# EAGLE design LDAQ-MOD-ADC8 (EAGLE 9.6.2)
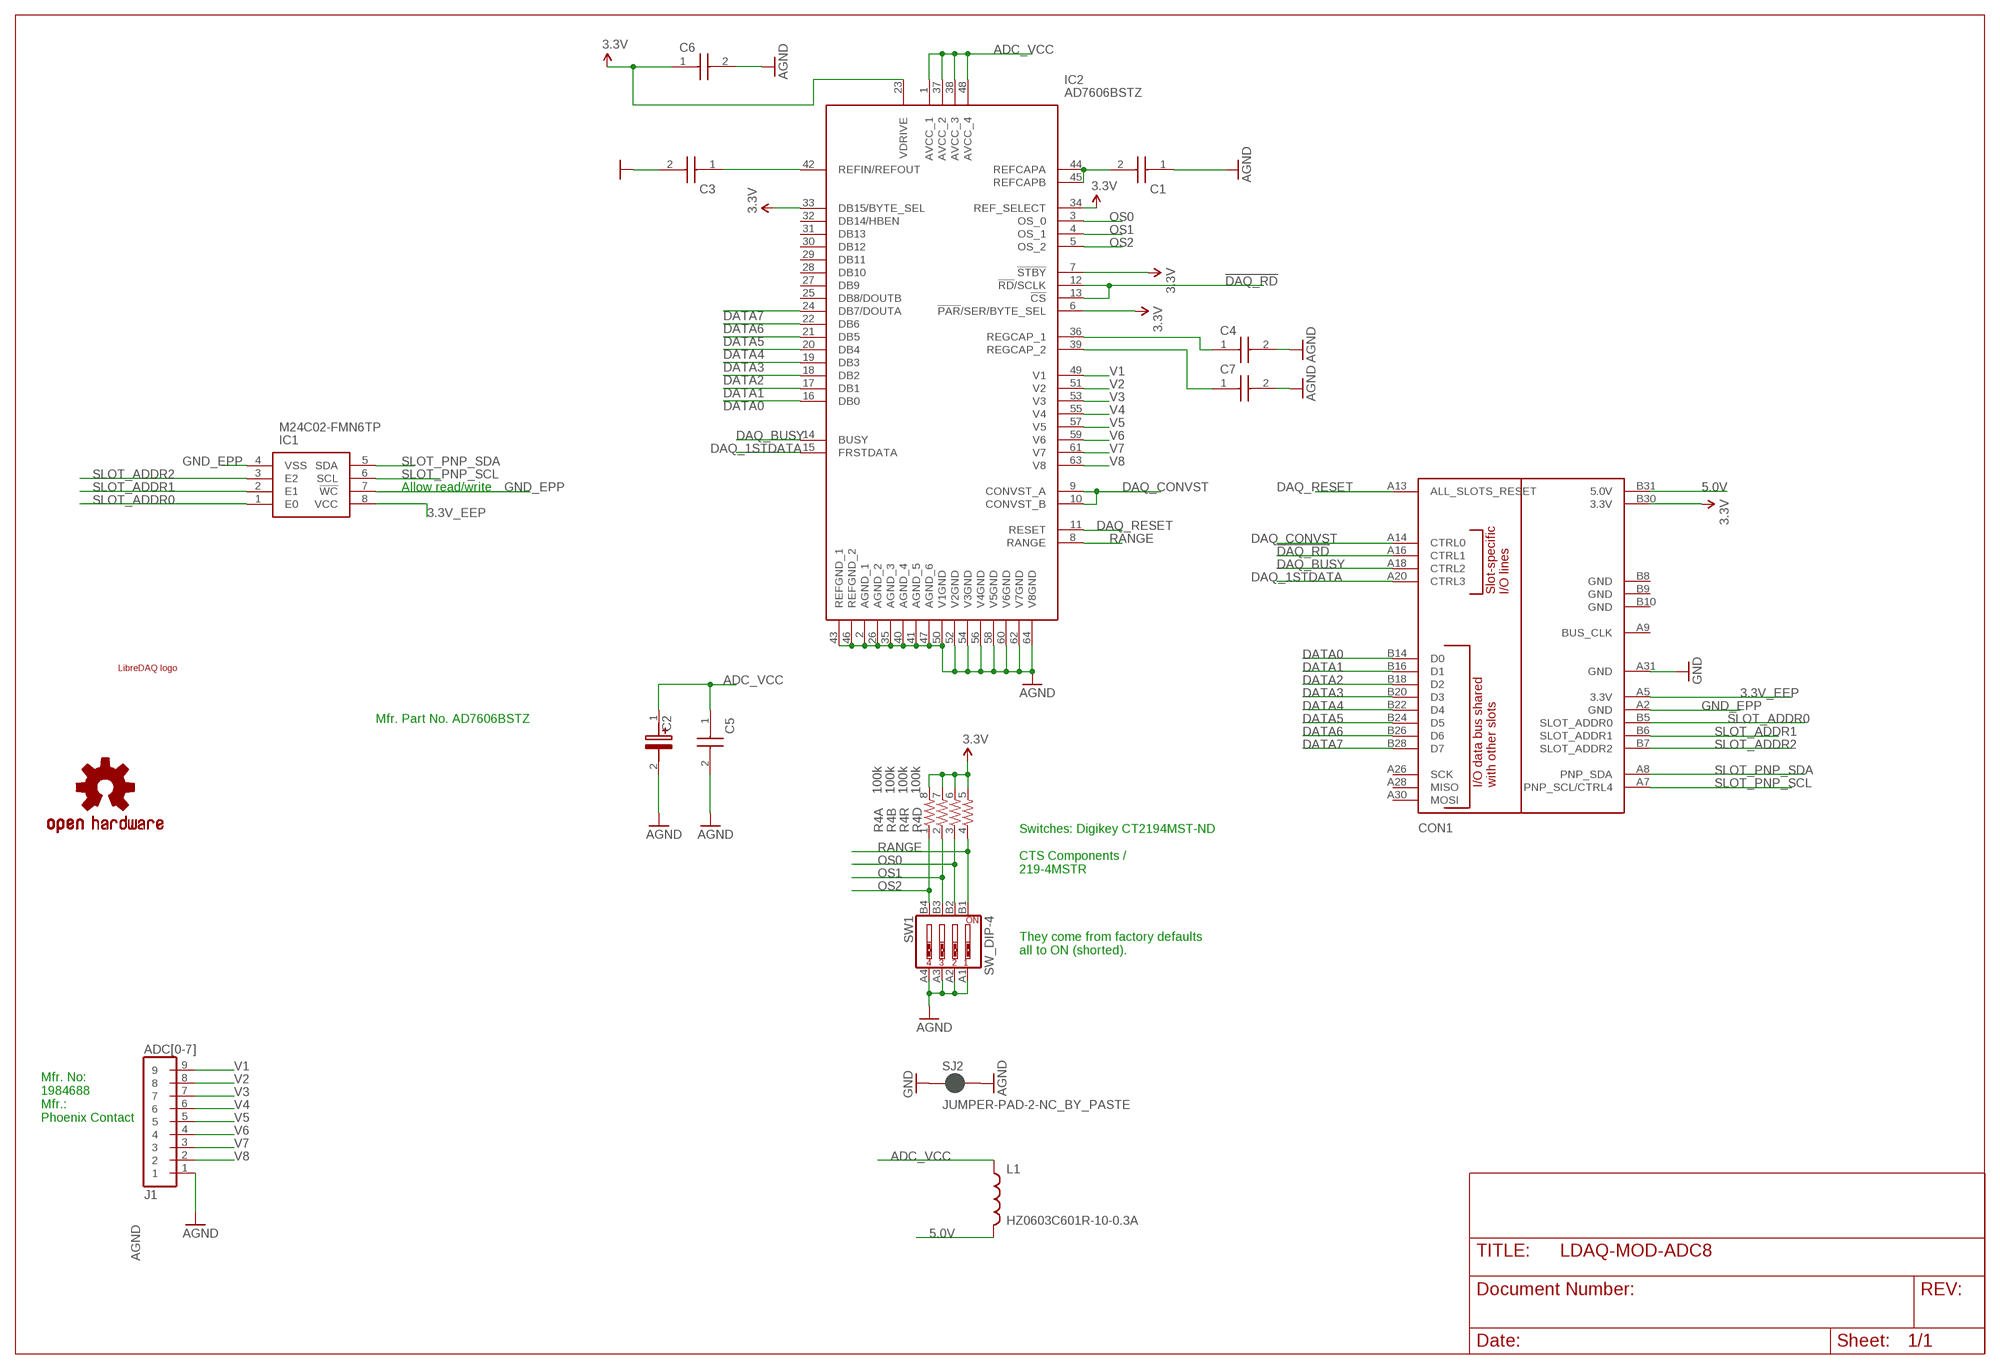
[diagram p0: schematic, sheet 1]

## Parts
C1  10uF  LMK105BJ225KV-F  [CAPC1005X55N]
C2  10uF  TAJB226M010RNJ  [CAPPM3528X210N]
C3  10uF  LMK105BJ225KV-F  [CAPC1005X55N]
C4  1.0uF  LMK105BJ225KV-F  [CAPC1005X55N]
C5  0.1uF  885012105010  [CAPC1005X55N]
C6  0.1uF  885012105010  [CAPC1005X55N]
C7  1.0uF  LMK105BJ225KV-F  [CAPC1005X55N]
CON1  BOARD  LIBREDAQ_DAUGHTER_BOARDPCIE-64-SIZE2  [PCI-E_64_EDGE_63X50]
IC1  M24C02-FMN6TP  [SOIC127P600X175-8N]
IC2  AD7606BSTZ  [QFP50P1200X1200X160-64N]
J1  ADC[0-7]  SCREWTERMINAL-3.5MM-9  [SCREWTERMINAL-3.5MM-9]
L1  HZ0603C601R-10-0.3A  INDUCTOR0603  [0603]
LOGO1  LIBREDAQ_LOGO_MINILOGO_GENERIC  [LIBREDAQ_LOGO]
LOGO2  OSHW-LOGOL  [OSHW-LOGO-L]
R4  100k  RESISTOR-ARRAY0603-ARV  [0603-ARV]
SJ2  JUMPER-PAD-2-NC_BY_PASTE  [PAD-JUMPER-2-NC_BY_PASTE_YES_SILK]
SW1  SW_DIP-4  [SW_SIP-4]

## Nets
3.3V: C6.1 CON1.B30(3.3V) IC2.6(!PAR!/SER/BYTE_SEL) IC2.7(!STBY) IC2.23(VDRIVE) IC2.33(DB15/BYTE_SEL) IC2.34(REF_SELECT) R4.5 R4.6 R4.7 R4.8
3.3V_EEP: CON1.A5(3.3V) IC1.8(VCC)
5.0V: CON1.B31(5.0V) L1.2
!DAQ_RD: CON1.A16(CTRL1) IC2.12(!RD!/SCLK) IC2.13(!CS)
ADC_VCC: C2.1(+) C5.1 IC2.1(AVCC_1) IC2.37(AVCC_2) IC2.38(AVCC_3) IC2.48(AVCC_4) L1.1
AGND: C1.1 C2.2(-) C3.2 C4.2 C5.2 C6.2 C7.2 IC2.2(AGND_1) IC2.26(AGND_2) IC2.35(AGND_3) IC2.40(AGND_4) IC2.41(AGND_5) IC2.43(REFGND_1) IC2.46(REFGND_2) IC2.47(AGND_6) IC2.50(V1GND) IC2.52(V2GND) IC2.54(V3GND) IC2.56(V4GND) IC2.58(V5GND) IC2.60(V6GND) IC2.62(V7GND) IC2.64(V8GND) J1.1 SJ2.2 SW1.A1 SW1.A2 SW1.A3 SW1.A4
DAQ_1STDATA: CON1.A20(CTRL3) IC2.15(FRSTDATA)
DAQ_BUSY: CON1.A18(CTRL2) IC2.14(BUSY)
DAQ_CONVST: CON1.A14(CTRL0) IC2.9(CONVST_A) IC2.10(CONVST_B)
DAQ_RESET: CON1.A13(ALL_SLOTS_RESET) IC2.11(RESET)
DATA0: CON1.B14(D0) IC2.16(DB0)
DATA1: CON1.B16(D1) IC2.17(DB1)
DATA2: CON1.B18(D2) IC2.18(DB2)
DATA3: CON1.B20(D3) IC2.19(DB3)
DATA4: CON1.B22(D4) IC2.20(DB4)
DATA5: CON1.B24(D5) IC2.21(DB5)
DATA6: CON1.B26(D6) IC2.22(DB6)
DATA7: CON1.B28(D7) IC2.24(DB7/DOUTA)
GND: CON1.A31(GND) SJ2.1
GND_EPP: CON1.A2(GND) IC1.4(VSS) IC1.7(!WC)
N$1: C1.2 IC2.44(REFCAPA) IC2.45(REFCAPB)
N$2: C4.1 IC2.36(REGCAP_1)
N$3: C7.1 IC2.39(REGCAP_2)
N$35: C3.1 IC2.42(REFIN/REFOUT)
OS0: IC2.3(OS_0) R4.3 SW1.B2
OS1: IC2.4(OS_1) R4.2 SW1.B3
OS2: IC2.5(OS_2) R4.1 SW1.B4
RANGE: IC2.8(RANGE) R4.4 SW1.B1
SLOT_ADDR0: CON1.B5(SLOT_ADDR0) IC1.1(E0)
SLOT_ADDR1: CON1.B6(SLOT_ADDR1) IC1.2(E1)
SLOT_ADDR2: CON1.B7(SLOT_ADDR2) IC1.3(E2)
SLOT_PNP_SCL: CON1.A7(PNP_SCL/CTRL4) IC1.6(SCL)
SLOT_PNP_SDA: CON1.A8(PNP_SDA) IC1.5(SDA)
V1: IC2.49(V1) J1.9
V2: IC2.51(V2) J1.8
V3: IC2.53(V3) J1.7
V4: IC2.55(V4) J1.6
V5: IC2.57(V5) J1.5
V6: IC2.59(V6) J1.4
V7: IC2.61(V7) J1.3
V8: IC2.63(V8) J1.2
Unconnected: CON1.A9(BUS_CLK) CON1.A26(SCK) CON1.A28(MISO) CON1.A30(MOSI) CON1.B8(GND) CON1.B9(GND) CON1.B10(GND) IC2.25(DB8/DOUTB) IC2.27(DB9) IC2.28(DB10) IC2.29(DB11) IC2.30(DB12) IC2.31(DB13) IC2.32(DB14/HBEN)

## Notes on the sheet
- Allow read/write
- Mfr. Part No. AD7606BSTZ
- Switches: Digikey CT2194MST-ND
  
  CTS Components / 
  219-4MSTR
  
  
  
  
  They come from factory defaults 
  all to ON (shorted).
- Mfr. No:
  1984688
  Mfr.:
  Phoenix Contact

## Library data of the parts
C1 C3 C4 C7 = LMK105BJ225KV-F:LMK105BJ225KV-F: TAIYO YUDEN - LMK105BJ225KV-F - CAP ,MLCC ,0402,10V ,X5R,2.2UF10% ,T&R Source: Datasheet <https://datasheet.lcsc.com/szlcsc/Taiyo-Yuden-LMK105BJ225KV-F_C319191.pdf>; DESCRIPTION: TAIYO YUDEN - LMK105BJ225KV-F - CAP ,MLCC ,0402,10V ,X5R,2.2UF10% ,T&R; HEIGHT: 0.55mm; MANUFACTURER_NAME: TAIYO YUDEN; MANUFACTURER_PART_NUMBER: LMK105BJ225KV-F; MOUSER_PART_NUMBER: 963-LMK105BJ225KV-F; MOUSER_PRICE-STOCK: https://www.mouser.co.uk/ProductDetail/Taiyo-Yuden/LMK105BJ225KV-F?qs=lkMpTOwszhdMcDOeuc5Dig%3D%3D
C2 = TAJB226M010RNJ:TAJB226M010RNJ: Tantalum Capacitors - Solid SMD 10volts 22uF 20% Source: Datasheet <http://datasheets.avx.com/TAJ.pdf>; DESCRIPTION: Tantalum Capacitors - Solid SMD 10volts 22uF 20%; HEIGHT: 2.1mm; MANUFACTURER_NAME: AVX; MANUFACTURER_PART_NUMBER: TAJB226M010RNJ; MOUSER_PART_NUMBER: 581-TAJB226M010R; MOUSER_PRICE-STOCK: https://www.mouser.co.uk/ProductDetail/AVX/TAJB226M010RNJ?qs=mgX5NEyWO4RGWl43WOyCZQ%3D%3D
C5 C6 = 885012105010:885012105010: Multilayer Ceramic Chip Capacitor WCAP-CSGP Series 0402 100000pF X5R0402104M010DFCT10000 Source: Datasheet <https://katalog.we-online.com/pbs/datasheet/885012105010.pdf>; DESCRIPTION: Multilayer Ceramic Chip Capacitor WCAP-CSGP Series 0402 100000pF X5R0402104M010DFCT10000; HEIGHT: 0.55mm; MANUFACTURER_NAME: Wurth Elektronik; MANUFACTURER_PART_NUMBER: 885012105010; MOUSER_PART_NUMBER: 710-885012105010; MOUSER_PRICE-STOCK: https://www.mouser.co.uk/ProductDetail/Wurth-Elektronik/885012105010?qs=0KOYDY2FL298aE%252BL5D%252BNKw%3D%3D
CON1 = libredaq-comps:LIBREDAQ_DAUGHTER_BOARD: LibreDAQ Expansion board (PCI-E form)
IC1 = SamacSys_Parts:M24C02-FMN6TP: EEPROM 2-Kbit serial I2C Bus EEPROM Source: Datasheet <http://www.st.com/content/ccc/resource/technical/document/datasheet/b0/d8/50/40/5a/85/49/6f/DM00071904.pdf/files/DM00071904.pdf/jcr:content/translations/en.DM00071904.pdf>; DESCRIPTION: EEPROM 2-Kbit serial I2C Bus EEPROM; HEIGHT: 1.75mm; MANUFACTURER_NAME: STMicroelectronics; MANUFACTURER_PART_NUMBER: M24C02-FMN6TP; MOUSER_PART_NUMBER: 511-M24C02-FMN6TP; MOUSER_PRICE-STOCK: https://www.mouser.co.uk/ProductDetail/STMicroelectronics/M24C02-FMN6TP?qs=WHlX%252B%252B9%2FRwCvVyrf2ztAog%3D%3D
IC2 = SamacSys_Parts:AD7606BSTZ: Bipolar Input, Simultaneous Sampling ADC Source: Datasheet <https://componentsearchengine.com/Datasheets/2/AD7606BSTZ.pdf>; DESCRIPTION: Bipolar Input, Simultaneous Sampling ADC; HEIGHT: 1.6mm; MANUFACTURER_NAME: Analog Devices; MANUFACTURER_PART_NUMBER: AD7606BSTZ; MOUSER_PART_NUMBER: 584-AD7606BSTZ; MOUSER_PRICE-STOCK: https://www.mouser.co.uk/ProductDetail/Analog-Devices/AD7606BSTZ?qs=%2FtpEQrCGXCxOGkaD7urMag%3D%3D
J1 = libredaq-comps:SCREWTERMINAL-3.5MM-9
L1 = SparkFun-Passives:INDUCTOR: Inductors Basic Inductor/Choke - 0603 and 1206. Footprints are not proven and vary greatly between part numbers. SRN6045- 33uH, 20% 1.4A SDR0403-560KL - 56uH, 10%, 500mA RMS/740mA peak
LOGO1 = libredaq-comps:LIBREDAQ_LOGO_MINI
LOGO2 = SparkFun-Aesthetics:OSHW-LOGO: Open Source Hardware Logo This logo indicates the piece of hardware it is found on incorporates a OSHW license and/or adheres to the definition of open source hardware found here: http://freedomdefined.org/OSHW
R4 = SparkFun-Resistors:RESISTOR-ARRAY: Array Chip Resistor Source: RS Component / Phycomp
SJ2 = SparkFun-Passives:JUMPER-PAD-2-NC_BY_PASTE
SW1 = libredaq-comps:SW_DIP-4

## Board
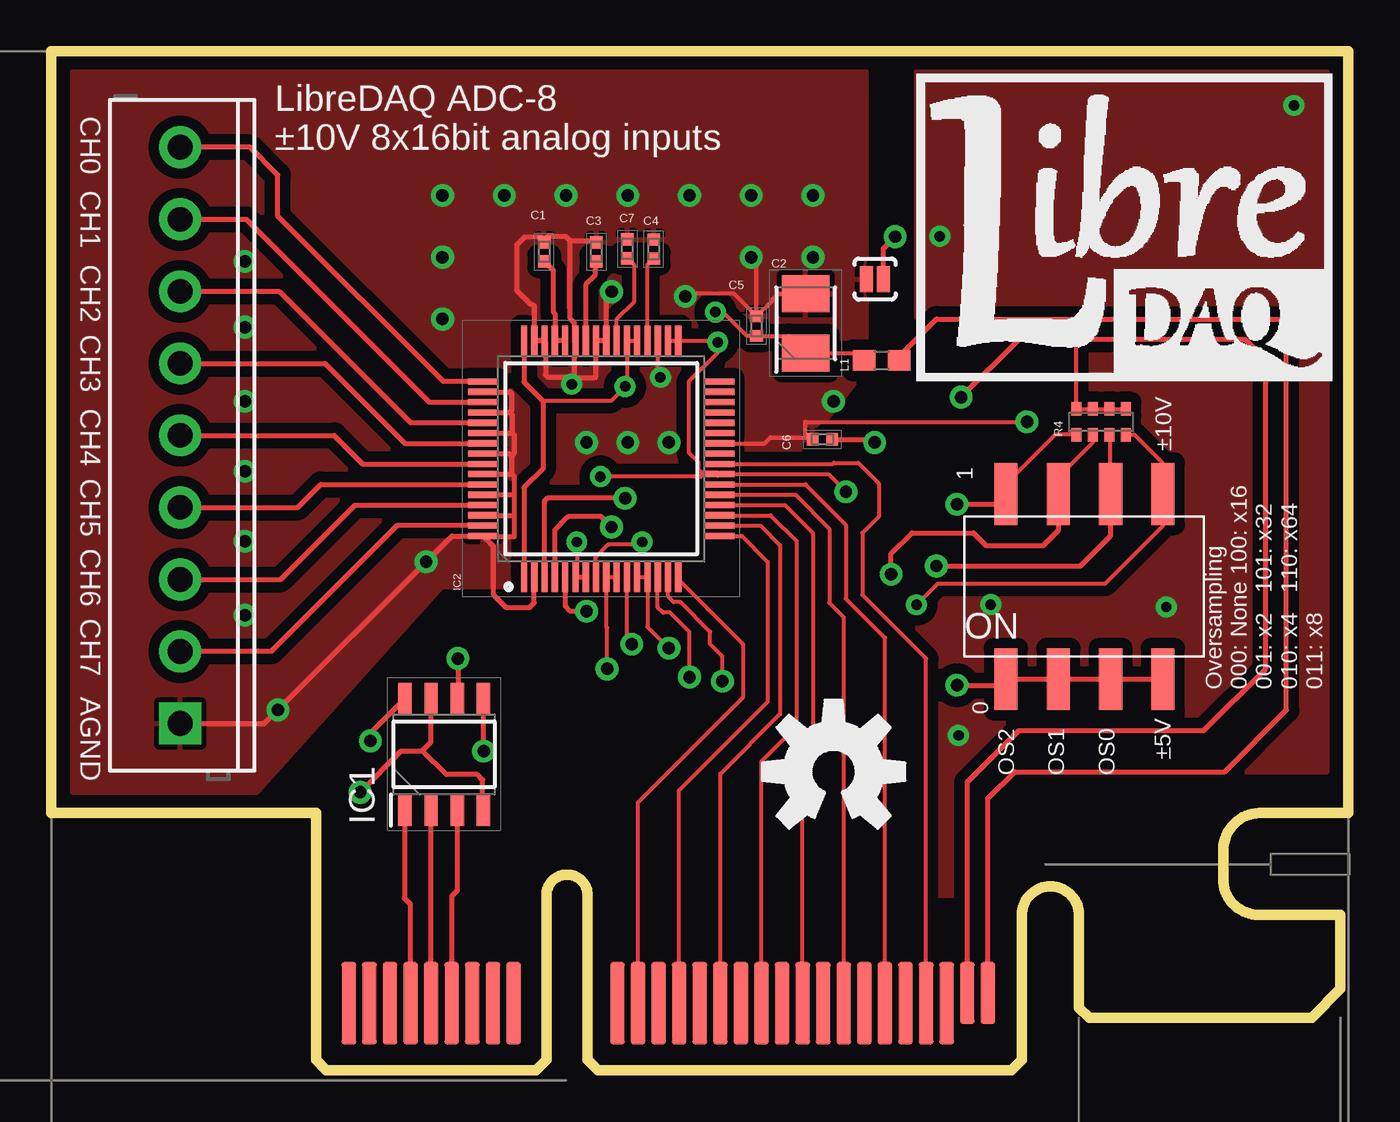
[diagram p1: board, top side]
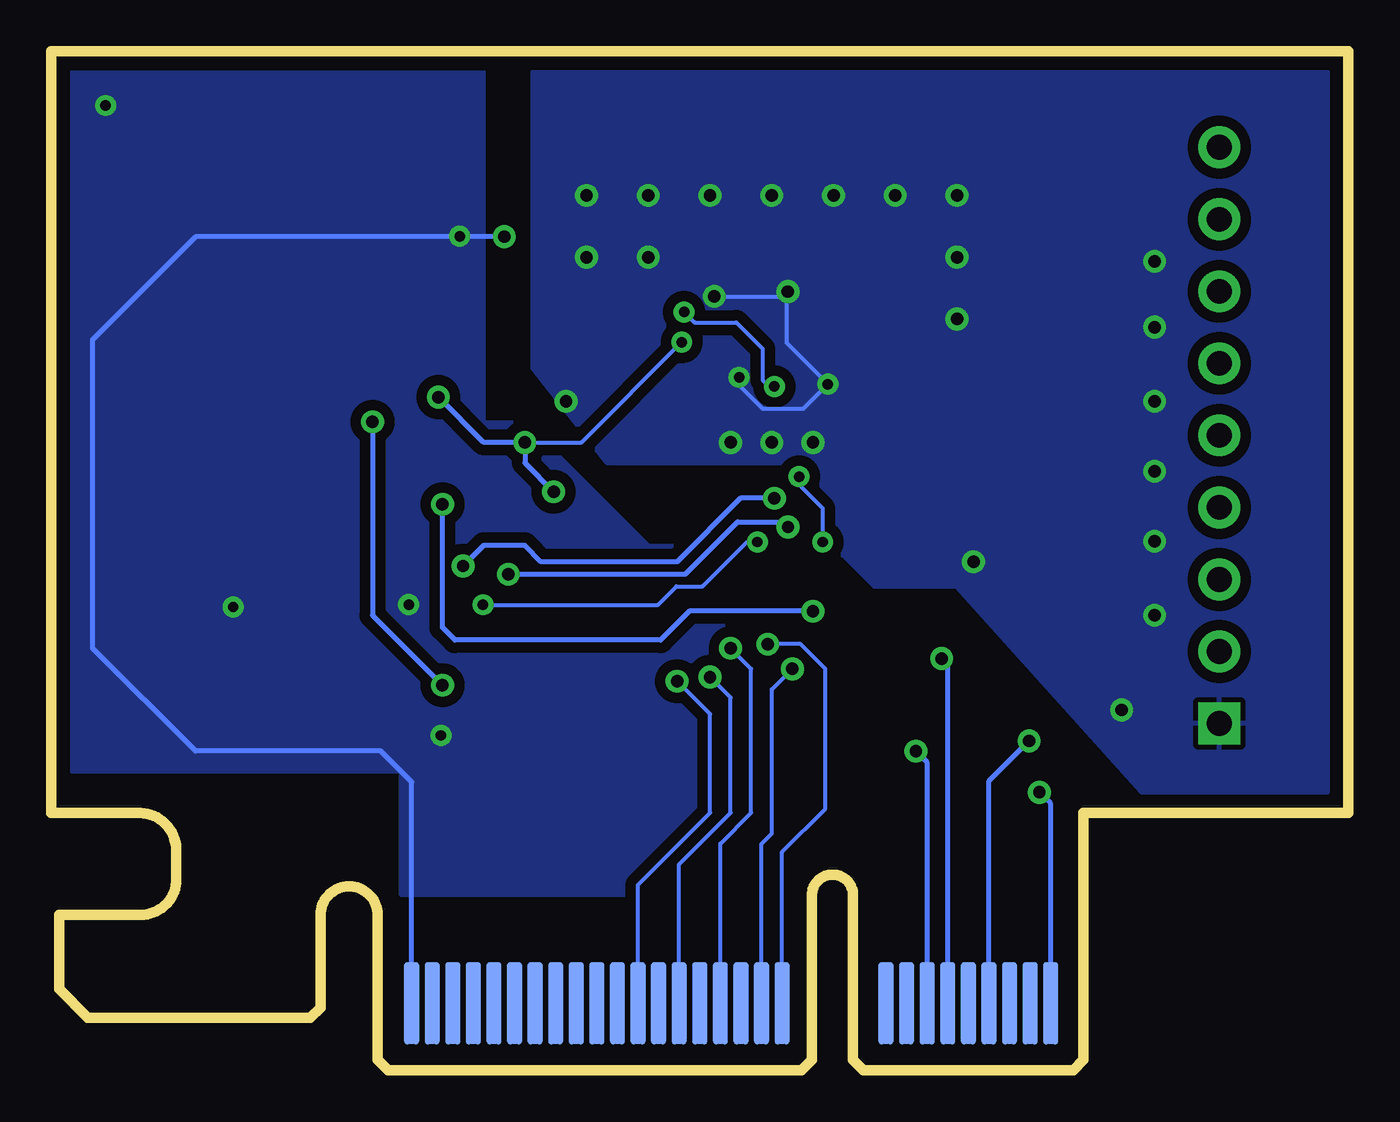
[diagram p2: board, bottom side, seen from below]

Size 63 x 49.5 mm. Coordinates in mm from the lower left corner, seen from the top.
Copper layers (1*16): Top 0.035mm / dielectric 1.5mm / Bottom 0.035mm
Design rules "LibreDAQ": minimum track width 8mil, minimum drill 20mil, track to track 8mil, track to pad 7mil, pad to pad 7mil, via to via 8mil, smd to smd 7mil, copper to edge 6mil, drill to drill 8mil, minimum pad ring 12mil, minimum via ring 10mil, stop-mask expansion 4mil, vias tented up to drill 25mil, thermal gap 10mil

### Footprints (pad centres in the part's own frame; a part is rotated, then mirrored left to right if it is on the bottom)
CAPC1005X55N = smd 0.6 x 0.62: 1 -0.46,0; 2 0.46,0
CAPPM3528X210N = smd 1.8 x 2.3: 1 -1.45,0; 2 1.45,0
CAPC1005X55N' = smd 0.56 x 0.62: 1 -0.48,0; 2 0.48,0
PCI-E_64_EDGE_63X50 = smd 0.7 x 4 bottom: A2 -10.55,3.75; A3 -9.55,3.75; A4 -8.55,3.75; A5 -7.55,3.75; A6 -6.55,3.75; A7 -5.55,3.75; A8 -4.55,3.75; A9 -3.55,3.75; A10 -2.55,3.75; A13 2.5,3.75; A14 3.5,3.75; A15 4.5,3.75; A16 5.5,3.75; A17 6.5,3.75; A18 7.5,3.75; A19 8.5,3.75; A20 9.5,3.75; A21 10.5,3.75; A22 11.5,3.75; A23 12.5,3.75; A24 13.5,3.75; A25 14.5,3.75; A26 15.5,3.75; A27 16.5,3.75; A28 17.5,3.75; A29 18.5,3.75; A30 19.5,3.75; A31 20.5,3.75 | smd 0.7 x 4: B2 -10.55,3.75; B3 -9.55,3.75; B4 -8.55,3.75; B5 -7.55,3.75; B6 -6.55,3.75; B7 -5.55,3.75; B8 -4.55,3.75; B9 -3.55,3.75; B10 -2.55,3.75; B13 2.5,3.75; B14 3.5,3.75; B15 4.5,3.75; B16 5.5,3.75; B17 6.5,3.75; B18 7.5,3.75; B19 8.5,3.75; B20 9.5,3.75; B21 10.5,3.75; B22 11.5,3.75; B23 12.5,3.75; B24 13.5,3.75; B25 14.5,3.75; B26 15.5,3.75; B27 16.5,3.75; B28 17.5,3.75; B29 18.5,3.75 | smd 0.7 x 3: B30 19.5,4.25; B31 20.5,4.25
SOIC127P600X175-8N = smd 1.525 x 0.65: 1 -2.712,1.905; 2 -2.712,0.635; 3 -2.712,-0.635; 4 -2.712,-1.905; 5 2.712,-1.905; 6 2.712,-0.635; 7 2.712,0.635; 8 2.712,1.905
QFP50P1200X1200X160-64N = smd 1.475 x 0.3: 1 -5.738,3.75; 2 -5.738,3.25; 3 -5.738,2.75; 4 -5.738,2.25; 5 -5.738,1.75; 6 -5.738,1.25; 7 -5.738,0.75; 8 -5.738,0.25; 9 -5.738,-0.25; 10 -5.738,-0.75; 11 -5.738,-1.25; 12 -5.738,-1.75; 13 -5.738,-2.25; 14 -5.738,-2.75; 15 -5.738,-3.25; 16 -5.738,-3.75; 33 5.738,-3.75; 34 5.738,-3.25; 35 5.738,-2.75; 36 5.738,-2.25; 37 5.738,-1.75; 38 5.738,-1.25; 39 5.738,-0.75; 40 5.738,-0.25; 41 5.738,0.25; 42 5.738,0.75; 43 5.738,1.25; 44 5.738,1.75; 45 5.738,2.25; 46 5.738,2.75; 47 5.738,3.25; 48 5.738,3.75 | smd 0.3 x 1.475: 17 -3.75,-5.738; 18 -3.25,-5.738; 19 -2.75,-5.738; 20 -2.25,-5.738; 21 -1.75,-5.738; 22 -1.25,-5.738; 23 -0.75,-5.738; 24 -0.25,-5.738; 25 0.25,-5.738; 26 0.75,-5.738; 27 1.25,-5.738; 28 1.75,-5.738; 29 2.25,-5.738; 30 2.75,-5.738; 31 3.25,-5.738; 32 3.75,-5.738; 49 3.75,5.738; 50 3.25,5.738; 51 2.75,5.738; 52 2.25,5.738; 53 1.75,5.738; 54 1.25,5.738; 55 0.75,5.738; 56 0.25,5.738; 57 -0.25,5.738; 58 -0.75,5.738; 59 -1.25,5.738; 60 -1.75,5.738; 61 -2.25,5.738; 62 -2.75,5.738; 63 -3.25,5.738; 64 -3.75,5.738
SCREWTERMINAL-3.5MM-9 = drill 1.2 pad 2.032 square: 1 0,0 | drill 1.2 pad 2.032: 2 3.5,0; 3 7,0; 4 10.5,0; 5 14,0; 6 17.5,0; 7 21,0; 8 24.5,0; 9 28,0
0603 = smd 1.1 x 1: 1 -0.85,0; 2 0.85,0
0603-ARV = smd 0.5 x 0.65: 1 -1.2,-0.625; 2 -0.4,-0.625; 3 0.4,-0.625; 4 1.2,-0.625; 5 1.2,0.625; 6 0.4,0.625; 7 -0.4,0.625; 8 -1.2,0.625
PAD-JUMPER-2-NC_BY_PASTE_YES_SILK = smd 0.635 x 1.27: 1 -0.401,0; 2 0.413,0
SW_SIP-4 = smd 1.13 x 3: A1 0,4.5; A2 2.54,4.5; A3 5.08,4.5; A4 7.62,4.5; B1 0,-4.5; B2 2.54,-4.5; B3 5.08,-4.5; B4 7.62,-4.5

### Placement (x,y rotation side)
C1  23.94,39.77 270 top
C2  36.65,36.29 90 top
C3  26.48,39.77 90 top
C4  29.26,39.89 90 top
C5  0.1uF  [CAPC1005X55N']  34.26,36.15 90 top
C6  0.1uF  [CAPC1005X55N']  37.46,30.65 180 top
C7  27.98,39.91 90 top
CON1  25,-0.5 0 top
IC1  19.08,15.34 90 top
IC2  26.71,29.71 90 top
J1  6.25,16.84 90 top
L1  40.33,34.49 0 top
LOGO1  42,33.5 0 top
LOGO2  38,14.5 0 top
R4  51,31.5 0 top
SJ2  40.02,38.44 180 top
SW1  54,23.5 180 top

### Tracks (layer width: path | path; a pad name or v marks a point on that pad's centre or on a via)
3.3V  (via drill 0.51, 0.6)
  Top 0.203: R4.5 R4.6 R4.7 R4.8 49.8,35.5 | IC2.23 32.38,29.03 31.59,29.03 31.43,29.19 31.43,29.54 30.99,29.98 30.99,33.49 32.38,34.88 v32.38,35.38 32.3,35.45 IC2.33 IC2.34 | IC2.23 37.74,28.96 v38.6,28.1 | IC2.23 32.38,28.89 31.59,28.89 31.54,28.84 v26.67,28.84 | v25.53,25.66 25.53,24.04 IC2.6
  Top 0.254: C6.1 39.85,30.65 v40,30.5 | CON1.B30 44.5,14 47,16.5 56,16.5 59,19.5 59,34.5 58,35.5 49.8,35.5 47,35.5 v44.2,32.7 | IC2.6 IC2.7
  Bottom 0.203: v32.38,35.38 37.25,30.5 v40,30.5 | v26.67,28.84 26.67,28.46 25.53,27.31 v25.53,25.66
  Bottom 0.254: v38.6,28.1 40,29.5 v40,30.5 42,30.5 v44.2,32.7
3.3V_EEP  (via drill 0.6)
  Top 0.254: IC1.8 15.5,16.38 v15.5,16
  Bottom 0.254: v15.5,16 17.45,14.05 CON1.A5
5.0V
  Top 0.203: 41.25,34.75 41.25,34.56 L1.2
  Top 0.254: CON1.B31 45.5,13.2 46.8,14.5 57,14.5 60,17.5 60,36.5 43,36.5 41.25,34.75
!DAQ_RD  (via drill 0.6)
  Top 0.203: IC2.12 IC2.13 28.96,21.54 v30,20.5
  Bottom 0.203: CON1.A16 30.5,11 29,12.5 29,19.5 v30,20.5
ADC_VCC  (via drill 0.51)
  Top 0.203: IC2.37 IC2.38 27.96,33.3 v27.88,33.22 27.18,32.52 23.88,32.52 | L1.1 39.13,34.84 C2.1 35.81,35.67 C5.1 33.8,35.67 32.64,36.84 v32.26,36.84
  Top 0.254: IC2.48 22.96,33.44 23.88,32.52 23.88,29.22 22.96,28.3 IC2.1
  Bottom 0.203: v32.26,36.84 31.75,36.33 29.72,36.33 28.45,35.06 28.45,33.54 28.13,33.22 v27.88,33.22
AGND  (via drill 0.51, 0.6)
  Top 0.203: v47.4,31.5 36.62,31.5 36.62,30.75 C6.2 36.89,30.74 34.92,30.74 34.64,30.46 IC2.26 | 27.97,40.35 C7.2 | 24.13,33.66 24.94,33.66 v25.27,33.33 | C5.2 34.26,39.24 v34,39.5 | C5.2 35.05,37.43 35.05,37.47 35.32,37.74 C2.2 | v30.8,37.6 30.93,37.73 33.16,37.73 C5.2 | IC2.35 29.46,33.8 v29.59,33.66
  Top 0.254: 25.2,40.3 25,40.5 24.06,40.5 C1.1 23.83,40.5 23,40.5 22.6,40.1 22.6,37.9 23.28,37.22 23.37,37.22 23.46,37.13 IC2.47 IC2.46 24,35.4 24,35.26 24,33.79 24.13,33.66 25.4,33.66 | 25.2,40.3 26.16,40.3 C3.2 | J1.1 10.34,16.84 v11,17.5 v18.2,24.7 19.46,25.96 IC2.64 | SW1.A1 SW1.A2 SW1.A3 SW1.A4 46.08,18.7 v44,18.7 | IC2.62 22.45,26.96 | 22.45,26.96 22.48,26.93 22.48,25.92 21.01,25.92 IC2.64 | IC2.60 22.47,27.96 | 22.47,27.96 22.48,27.95 22.48,26.98 22.45,26.96 | IC2.58 22.36,28.96 | 22.36,28.96 22.48,28.84 22.48,27.97 22.47,27.96 | IC2.56 22.25,29.96 22.36,29.85 | 22.36,29.85 22.36,28.96 | IC2.54 22.39,30.96 | 22.39,30.96 22.48,30.87 22.48,29.97 22.36,29.85 | IC2.52 22.28,31.96 | 22.39,30.96 22.39,31.85 22.28,31.96 | IC2.50 22.3,32.96 22.35,32.9 22.35,32.03 22.28,31.96 | 25.2,40.3 25.2,36.52 25.42,36.31 25.42,35.49 IC2.43 25.42,35.4 25.42,34.59 25.4,34.57 25.4,33.66 | v27.22,37.83 26.96,37.57 IC2.40 IC2.41 26.46,33.71 26.42,33.66 25.4,33.66 | IC2.64 21.46,25.47 21.46,23.12 22.1,22.49 23.24,22.49 23.46,22.7 IC2.2
  Bottom 0.203: v30.8,37.6 27.45,37.6 27.27,37.77 27.27,35.33 v25.27,33.33 26.47,32.14 28.45,32.14 29.59,33.28 v29.59,33.66
  Bottom 0.254: 27.27,37.77 v27.22,37.83 | v47.4,31.5 47.4,22.1 v44,18.7
  other vias: 9.4,39.3 9.4,29.1 19,36.5 22,42.5 25,42.5 28,42.5 38,32.5 26,30.5 28,30.5 9.4,32.5 9.4,25.7 9.4,22.1 9.4,36.1 31,42.5 34,42.5 19,42.5 19,39.5 30,30.5 37,42.5 37,39.5
  pour Top (isolate 0.508): 1,48.5 1,13.5 10,13.5 19,23.5 23,23.5 26,26.5 26,29.5 36,29.5 39.6,34.1 39.6,48.5
  pour Bottom (isolate 0.508): 1,48.5 1,13.5 10,13.5 19,23.5 23,23.5 26,26.5 26,29.5 36,29.5 39.6,34.1 39.6,48.5
DAQ_1STDATA  (via drill 0.6)
  Top 0.203: v32.6,18.9 32.6,20.1 32,20.7 32,21.3 30.56,22.74 30.23,22.74 29.96,23.01 IC2.15
  Bottom 0.203: CON1.A20 34.5,9 31,12.5 31,17.3 v32.6,18.9
DAQ_BUSY  (via drill 0.6)
  Top 0.203: v31,19.1 31,21.3 30.9,21.4 30.48,21.82 30.07,22.23 29.72,22.23 29.46,22.49 IC2.14
  Bottom 0.203: CON1.A18 32.5,10 30,12.5 30,18.1 v31,19.1
DAQ_CONVST  (via drill 0.6)
  Top 0.203: v27,19.5 27,21.5 26.96,21.54 IC2.9 IC2.10
  Bottom 0.203: CON1.A14 28.5,11 28,11.5 28,18.5 v27,19.5
DAQ_RESET  (via drill 0.6)
  Top 0.203: IC2.11 27.94,23.95 27.94,20.96 v28.2,20.7
  Bottom 0.203: CON1.A13 27.5,10.6 25.4,12.7 25.4,19.5 26.6,20.7 v28.2,20.7
DATA0
  Top 0.203: CON1.B14 28.5,13 33.6,18.1 33.6,20.7 31.9,22.4 31.48,22.82 30.46,23.84 IC2.16
DATA1
  Top 0.203: CON1.B16 30.5,13.6 34.8,17.9 34.8,24.7 33.54,25.96 IC2.17
DATA2
  Top 0.203: CON1.B18 32.5,14.4 35.4,17.3 35.4,25.5 34.44,26.46 IC2.18
DATA3
  Top 0.203: CON1.B20 34.5,15 36.2,16.7 36.2,25.7 34.94,26.96 IC2.19
DATA4
  Top 0.203: CON1.B22 36.5,15 37,15.5 37,26.1 35.64,27.46 IC2.20
DATA5
  Top 0.203: CON1.B24 38.5,22 37.8,22.7 37.8,26.3 36.14,27.96 IC2.21
DATA6
  Top 0.203: CON1.B26 40.5,21 38.6,22.9 38.6,26.5 36.64,28.46 IC2.22
DATA7
  Top 0.203: CON1.B28 42.5,20 39.4,23.1 39.4,26.1 40.2,26.9 40.2,28.5 39.2,29.5 38,29.5 37.96,29.46 IC2.24
GND  (via drill 0.51, 0.6)
  Top 0.254: SJ2.1 40.42,39.92 v41,40.5
  Bottom 0.254: CON1.A31 45.5,14 47,15.5 56,15.5 61,20.5 61,35.5 56,40.5 v41,40.5
  other vias: 44.07,16.26 54.17,22.5 60.37,46.88 45.64,22.62 43.17,40.52
  pour Bottom (isolate 0.508): 26,8.5 46,8.5 46,14.5 62,14.5 62,48.5 42,48.5 42,31.5 40,31.5 34,25.5 27,25.5 24,21.5 24,10.5
  pour Top (isolate 0.508): 26,8.5 46,8.5 46,14.5 62,14.5 62,48.5 42,48.5 42,31.5 40,31.5 34,25.5 27,25.5 24,21.5 24,10.5
GND_EPP  (via drill 0.6)
  Top 0.254: v15,13.5 17,15.5 18,15.5 18.02,15.52 | 18.02,15.52 18.44,15.94 IC1.7 | IC1.4 20.95,12.66 20.95,14.11 20.7,14.36 19.18,14.36 18.02,15.52
  Bottom 0.254: CON1.A2 14.45,12.95 v15,13.5
N$1
  Top 0.254: C1.2 24.38,38.86 24.38,36.84 24.46,36.76 IC2.45 IC2.44
N$2
  Top 0.203: IC2.36 28.96,39.13 C4.1
N$3
  Top 0.203: IC2.39 27.46,36.48 28.32,37.35 28.32,39.11 C7.1
N$35
  Top 0.254: C3.1 26.4,38.84 26.4,38.6 25.96,38.16 IC2.42
OS0  (via drill 0.6)
  Top 0.203: SW1.B2 51.46,30.82 R4.3
  Top 0.254: v27.87,27.79 24.1,27.79 23.96,27.65 IC2.3 | v43,24.5 50,24.5 51.46,25.96 SW1.B2
  Bottom 0.254: v27.87,27.79 29.51,27.79 32.6,24.7 39.2,24.7 40,25.5 42,25.5 v43,24.5
OS1  (via drill 0.6)
  Top 0.203: R4.2 50.6,30.5 48.92,28.82 SW1.B3
  Top 0.254: v40.8,24.1 40.8,25.1 41.8,26.1 44.8,26.1 45.4,25.5 48.2,25.5 48.92,26.22 SW1.B3 | IC2.4 24.46,26.25 25.11,26.9 26.71,26.9 v27.22,26.39
  Bottom 0.254: v40.8,24.1 32.2,24.1 29.66,26.64 27.47,26.64 v27.22,26.39
OS2  (via drill 0.6)
  Top 0.203: R4.1 48.77,30.88 46.6,28.7 46.6,28.22 SW1.B4
  Top 0.254: v26,22.3 25.98,22.32 25.18,22.32 24.96,22.55 IC2.5 | v44,27.5 45.88,27.5 SW1.B4
  Bottom 0.254: v26,22.3 32,22.3 33.4,20.9 43.4,20.9 44,21.5 v44,27.5
RANGE  (via drill 0.51)
  Top 0.203: R4.4 52.62,30.88 54,29.5 SW1.B1 54,26.45 51.18,23.63 43.05,23.63 v42.04,22.61 | v28.7,25.66 28.57,25.53 27.05,25.53 26.42,24.89 26.42,24.01 IC2.8
  Bottom 0.203: v42.04,22.61 33.53,22.61 32.64,23.5 31.37,23.5 29.21,25.66 v28.7,25.66
SLOT_ADDR0
  Top 0.254: CON1.B5 17.45,8.05 17.16,8.34 17.16,12.62 IC1.1
SLOT_ADDR1
  Top 0.254: CON1.B6 IC1.2
SLOT_ADDR2
  Top 0.254: CON1.B7 19.45,8.45 19.71,8.71 IC1.3
SLOT_PNP_SCL  (via drill 0.6)
  Top 0.254: v19.75,20 19.75,18.09 IC1.6
  Bottom 0.254: CON1.A7 19.45,19.7 v19.75,20
SLOT_PNP_SDA  (via drill 0.6)
  Top 0.254: IC1.5 20.98,15.52 v21,15.5
  Bottom 0.254: v21,15.5 20.45,14.95 CON1.A8
V1
  Top 0.254: IC2.49 19.04,33.46 11,41.5 11,43.5 9.66,44.84 J1.9
V2
  Top 0.254: J1.8 9.46,41.34 18.35,32.46 IC2.51
V3
  Top 0.254: IC2.53 17.45,31.46 11.06,37.84 J1.7
V4
  Top 0.254: J1.6 13.29,34.34 17.18,30.46 IC2.55
V5
  Top 0.254: J1.5 13.74,30.84 15.13,29.46 IC2.57
V6
  Top 0.254: J1.4 11.97,27.34 13.08,28.46 IC2.59
V7
  Top 0.254: J1.3 11.14,23.84 14.75,27.46 IC2.61
V8
  Top 0.254: IC2.63 16.8,26.46 10.68,20.34 J1.2

### Text on the board
tPlace: CH0 | LibreDAQ ADC-8 / ±10V 8x16bit analog inputs | CH1 | CH2 | CH3 | CH4 | ±10V | 1 | CH5 | CH6 | CH7 | AGND | Oversampling / 000: None 100: x16 / 001: x2 101: x32 / 010: x4 110: x64 / 011: x8 | 0 | ±5V | OS2 / / OS1 / / OS0